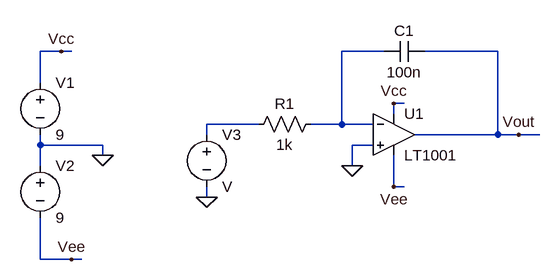
[diagram p0: schematic Draft1.asc]
Draft1.asc, the LTspice schematic file:
Version 4
SHEET 1 880 680
WIRE -304 64 -336 64
WIRE -288 64 -304 64
WIRE 192 64 128 64
WIRE 368 64 256 64
WIRE -336 112 -336 64
WIRE 224 144 208 144
WIRE 208 160 208 144
WIRE 0 176 -80 176
WIRE 128 176 128 64
WIRE 128 176 80 176
WIRE 176 176 128 176
WIRE -80 192 -80 176
WIRE 368 192 368 64
WIRE 368 192 240 192
WIRE 400 192 368 192
WIRE 432 192 400 192
WIRE -336 208 -336 192
WIRE -240 208 -336 208
WIRE 176 208 144 208
WIRE -240 224 -240 208
WIRE -336 240 -336 208
WIRE 144 240 144 208
WIRE 208 272 208 224
WIRE 224 272 208 272
WIRE -80 288 -80 272
WIRE -336 384 -336 320
WIRE -288 384 -336 384
WIRE -272 384 -288 384
FLAG -304 64 Vcc
FLAG -288 384 Vee
FLAG -240 224 0
FLAG 208 144 Vcc
FLAG 208 272 Vee
FLAG 144 240 0
FLAG 400 192 Vout
FLAG -80 288 0
SYMBOL OpAmps\\LT1001 208 128 R0
SYMATTR InstName U1
SYMBOL voltage -336 96 R0
WINDOW 123 0 0 Left 0
WINDOW 39 0 0 Left 0
SYMATTR InstName V1
SYMATTR Value 9
SYMBOL voltage -336 224 R0
WINDOW 123 0 0 Left 0
WINDOW 39 0 0 Left 0
SYMATTR InstName V2
SYMATTR Value 9
SYMBOL res 96 160 R90
WINDOW 0 0 56 VBottom 2
WINDOW 3 32 56 VTop 2
SYMATTR InstName R1
SYMATTR Value 1k
SYMBOL cap 256 48 R90
WINDOW 0 0 32 VBottom 2
WINDOW 3 32 32 VTop 2
SYMATTR InstName C1
SYMATTR Value 100n
SYMBOL voltage -80 176 R0
SYMATTR InstName V3

The netlist it stands for:
* Draft1.asc
XU1 0 N001 Vcc Vee Vout LT1001  ; pins In+ In- V+ V- OUT
V1 Vcc 0 9
V2 0 Vee 9
R1 N001 N002 1k
C1 Vout N001 100n
V3 N002 0 V
.lib LTC.lib
.backanno
.end